# Altium project apt_battery_bms.PrjPCB (part 4 of 4)

## Sheet cell_connector.SchDoc
size Tabloid
Used 13 times, as channels U_cell_connector, U_cell_connector, U_cell_connector, U_cell_connector, U_cell_connector, U_cell_connector, U_cell_connector, U_cell_connector, U_cell_connector, U_cell_connector, U_cell_connector, U_cell_connector, U_cell_connector. Parts and nets are listed once, with the designators drawn on the sheet.
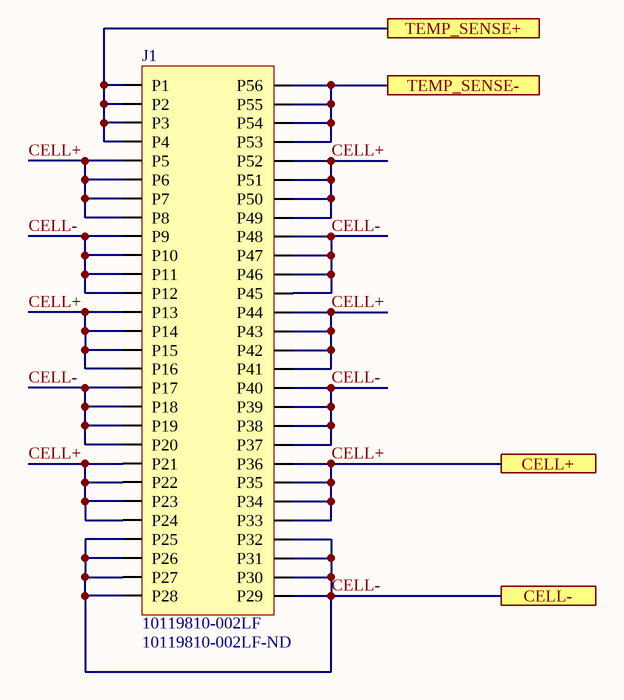
[diagram p4: cell_connector.SchDoc]

### Parts
J1  10119810-002LF  Supplier Part Number 1: 10119810-002LF-ND  [10119810-002LF - Connector]

### Ports
CELL+, CELL-, TEMP_SENSE+, TEMP_SENSE-

### Nets
CELL+: J1.P5 J1.P6 J1.P7 J1.P8 J1.P13 J1.P14 J1.P15 J1.P16 J1.P21 J1.P22 J1.P23 J1.P24 J1.P33 J1.P34 J1.P35 J1.P36 J1.P41 J1.P42 J1.P43 J1.P44 J1.P49 J1.P50 J1.P51 J1.P52 ; port CELL+
CELL-: J1.P9 J1.P10 J1.P11 J1.P12 J1.P17 J1.P18 J1.P19 J1.P20 J1.P25 J1.P26 J1.P27 J1.P28 J1.P29 J1.P30 J1.P31 J1.P32 J1.P37 J1.P38 J1.P39 J1.P40 J1.P45 J1.P46 J1.P47 J1.P48 ; port CELL-
TEMP_SENSE+: J1.P1 J1.P2 J1.P3 J1.P4 ; port TEMP_SENSE+
TEMP_SENSE-: J1.P53 J1.P54 J1.P55 J1.P56 ; port TEMP_SENSE-

### Channels
U_cell_connector: designators end in _U_cell_connector#1; ports CELL+=CELL+ CELL-=BAT- TEMP_SENSE+=NetJ1_U_cell_connector#1_P1 TEMP_SENSE-=NetJ1_U_cell_connector#1_P53
U_cell_connector: designators end in _U_cell_connector#2; ports CELL+=CELL+ CELL-=CELL+ TEMP_SENSE+=NetJ1_U_cell_connector#2_P1 TEMP_SENSE-=NetJ1_U_cell_connector#2_P53
U_cell_connector: designators end in _U_cell_connector#3; ports CELL+=CELL+ CELL-=CELL+ TEMP_SENSE+=NetJ1_U_cell_connector#3_P1 TEMP_SENSE-=NetJ1_U_cell_connector#3_P53
U_cell_connector: designators end in _U_cell_connector#4; ports CELL+=CELL+ CELL-=CELL+ TEMP_SENSE+=NetJ1_U_cell_connector#4_P1 TEMP_SENSE-=NetJ1_U_cell_connector#4_P53
U_cell_connector: designators end in _U_cell_connector#5; ports CELL+=CELL+ CELL-=CELL+ TEMP_SENSE+=NetJ1_U_cell_connector#5_P1 TEMP_SENSE-=NetJ1_U_cell_connector#5_P53
U_cell_connector: designators end in _U_cell_connector#6; ports CELL+=CELL+ CELL-=CELL+ TEMP_SENSE+=NetJ1_U_cell_connector#6_P1 TEMP_SENSE-=NetJ1_U_cell_connector#6_P53
U_cell_connector: designators end in _U_cell_connector#7; ports CELL+=CELL+ CELL-=CELL+ TEMP_SENSE+=NetJ1_U_cell_connector#7_P1 TEMP_SENSE-=NetJ1_U_cell_connector#7_P53
U_cell_connector: designators end in _U_cell_connector#8; ports CELL+=CELL+ CELL-=CELL+ TEMP_SENSE+=NetJ1_U_cell_connector#8_P1 TEMP_SENSE-=NetJ1_U_cell_connector#8_P53
U_cell_connector: designators end in _U_cell_connector#9; ports CELL+=CELL+ CELL-=CELL+ TEMP_SENSE+=NetJ1_U_cell_connector#9_P1 TEMP_SENSE-=NetJ1_U_cell_connector#9_P53
U_cell_connector: designators end in _U_cell_connector#10; ports CELL+=CELL+ CELL-=CELL+ TEMP_SENSE+=NetJ1_U_cell_connector#10_P1 TEMP_SENSE-=NetJ1_U_cell_connector#10_P53
U_cell_connector: designators end in _U_cell_connector#11; ports CELL+=CELL+ CELL-=CELL+ TEMP_SENSE+=NetJ1_U_cell_connector#11_P1 TEMP_SENSE-=NetJ1_U_cell_connector#11_P53
U_cell_connector: designators end in _U_cell_connector#12; ports CELL+=CELL+ CELL-=CELL+ TEMP_SENSE+=NetJ1_U_cell_connector#12_P1 TEMP_SENSE-=NetJ1_U_cell_connector#12_P53
U_cell_connector: designators end in _U_cell_connector#13; ports CELL+=430_Power CELL-=CELL+ TEMP_SENSE+=NetJ1_U_cell_connector#13_P1 TEMP_SENSE-=NetJ1_U_cell_connector#13_P53

### Library data of the parts
J1 = 10119810-002LF - Connector: 56 Position Female Connector Non Specified - Dual Edge Gold or Gold, GXT™  Black; Manufacturer: Amphenol ICC (FCI); Supplier 1: Digi-Key; ComponentLink1Description: https://cdn.amphenol-icc.com/media/wysiwyg/files/drawing/10119810.pdf; ComponentLink1URL: https://cdn.amphenol-icc.com/media/wysiwyg/files/drawing/10119810.pdf; Manufacturer Part Number: 10119810-002LF; Detailed Description: 56 Position Female Connector Non Specified - Dual Edge Gold or Gold, GXT™  Black; System: Connector

## Nets that join several sheets
BAT-: top (21 pins), monitoring (16 pins), control_and_gauge (19 pins), fet_driver (8 pins), U_cell_connector (24 pins)
SGND: top (P6.3), control_and_gauge (9 pins)
5V: top (5 pins), control_and_gauge (C4.2 C5.2 PS1.2 U5.28)
430_Power: top (8 pins), monitoring (6 pins), control_and_gauge (IC2.2 R1.2 U5.17), U_cell_connector (24 pins)
CELL+: monitoring (7 pins), U_cell_connector (24 pins), U_cell_connector (24 pins)
CELL+: monitoring (7 pins), U_cell_connector (24 pins), U_cell_connector (24 pins)
CELL+: monitoring (5 pins), U_cell_connector (24 pins), U_cell_connector (24 pins)
CELL+: monitoring (5 pins), U_cell_connector (24 pins), U_cell_connector (24 pins)
CELL+: monitoring (5 pins), U_cell_connector (24 pins), U_cell_connector (24 pins)
CELL+: monitoring (5 pins), U_cell_connector (24 pins), U_cell_connector (24 pins)
CELL+: monitoring (5 pins), U_cell_connector (24 pins), U_cell_connector (24 pins)
CELL+: monitoring (5 pins), U_cell_connector (24 pins), U_cell_connector (24 pins)
CELL+: monitoring (5 pins), U_cell_connector (24 pins), U_cell_connector (24 pins)
CELL+: monitoring (5 pins), U_cell_connector (24 pins), U_cell_connector (24 pins)
CELL+: monitoring (5 pins), U_cell_connector (24 pins), U_cell_connector (24 pins)
CELL+: monitoring (5 pins), U_cell_connector (24 pins), U_cell_connector (24 pins)
NetC10_2: control_and_gauge (U5.16), fet_driver (C10.2 D14.2 R36.2 R38.2)
NetC19_2: monitoring (C19.2 R60.2 U7.44), control_and_gauge (U5.6)
NetC41_2: top (5 pins), fet_driver (D8.1 IC4.3 R20.2 R22.2)
NetC44_2: top (C44.2 IC22.3 U8.2 U8.3), fet_driver (R24.2)
NetC49_2: top (C49.2 C50.1 R122.1), monitoring (U7.42)
NetC50_2: top (C50.2 C51.1 R123.1), monitoring (U7.43)
NetC52_2: top (C52.2 C53.1 R124.1), control_and_gauge (U1.9)
NetC53_2: top (C53.2 C54.1 R125.1), control_and_gauge (U1.10)
NetD1_2: top (P6.1), control_and_gauge (D1.2 R9.1 U2.6)
NetD2_2: top (P6.2), control_and_gauge (D2.2 R9.2 U2.7)
NetD8_2: top (FB1.2 FB3.2 FB6.1), fet_driver (D8.2 D11.2 IC4.2 R20.1)
NetD9_2: top (FB2.1 FB4.1 FB5.1), fet_driver (D9.2 IC3.3 R21.1 R31.2)
NetD18_1: top (IC24.1), fet_driver (D18.1 R39.2 R40.2)
NetD18_2: top (7 pins), fet_driver (D18.2 R40.1)
NetIC5_1: control_and_gauge (U5.5), fet_driver (IC5.1)
NetP7_1: top (P7.1), control_and_gauge (U5.9)
NetR28_1: monitoring (U7.2), fet_driver (R28.1)
NetR29_1: control_and_gauge (U5.10), fet_driver (R29.1)
NetR32_1: monitoring (U7.1), fet_driver (R32.1)
NetR35_1: control_and_gauge (U5.11), fet_driver (R35.1)
NetR109_2: monitoring (R109.2), control_and_gauge (U5.8)
Pack+: top (9 pins), monitoring (D36.2 IC19.2 R105.1), fet_driver (6 pins)
Pack-: top (7 pins), monitoring (D40.1 R111.2), fet_driver (D15.1 D16.1 R27.1)
REGOUT: top (D42.1), monitoring (C15.2 U7.8)
SCL: monitoring (U7.5), control_and_gauge (P1.3 R13.2 U1.13)
SDA: monitoring (U7.4), control_and_gauge (P1.1 R12.2 U1.14)